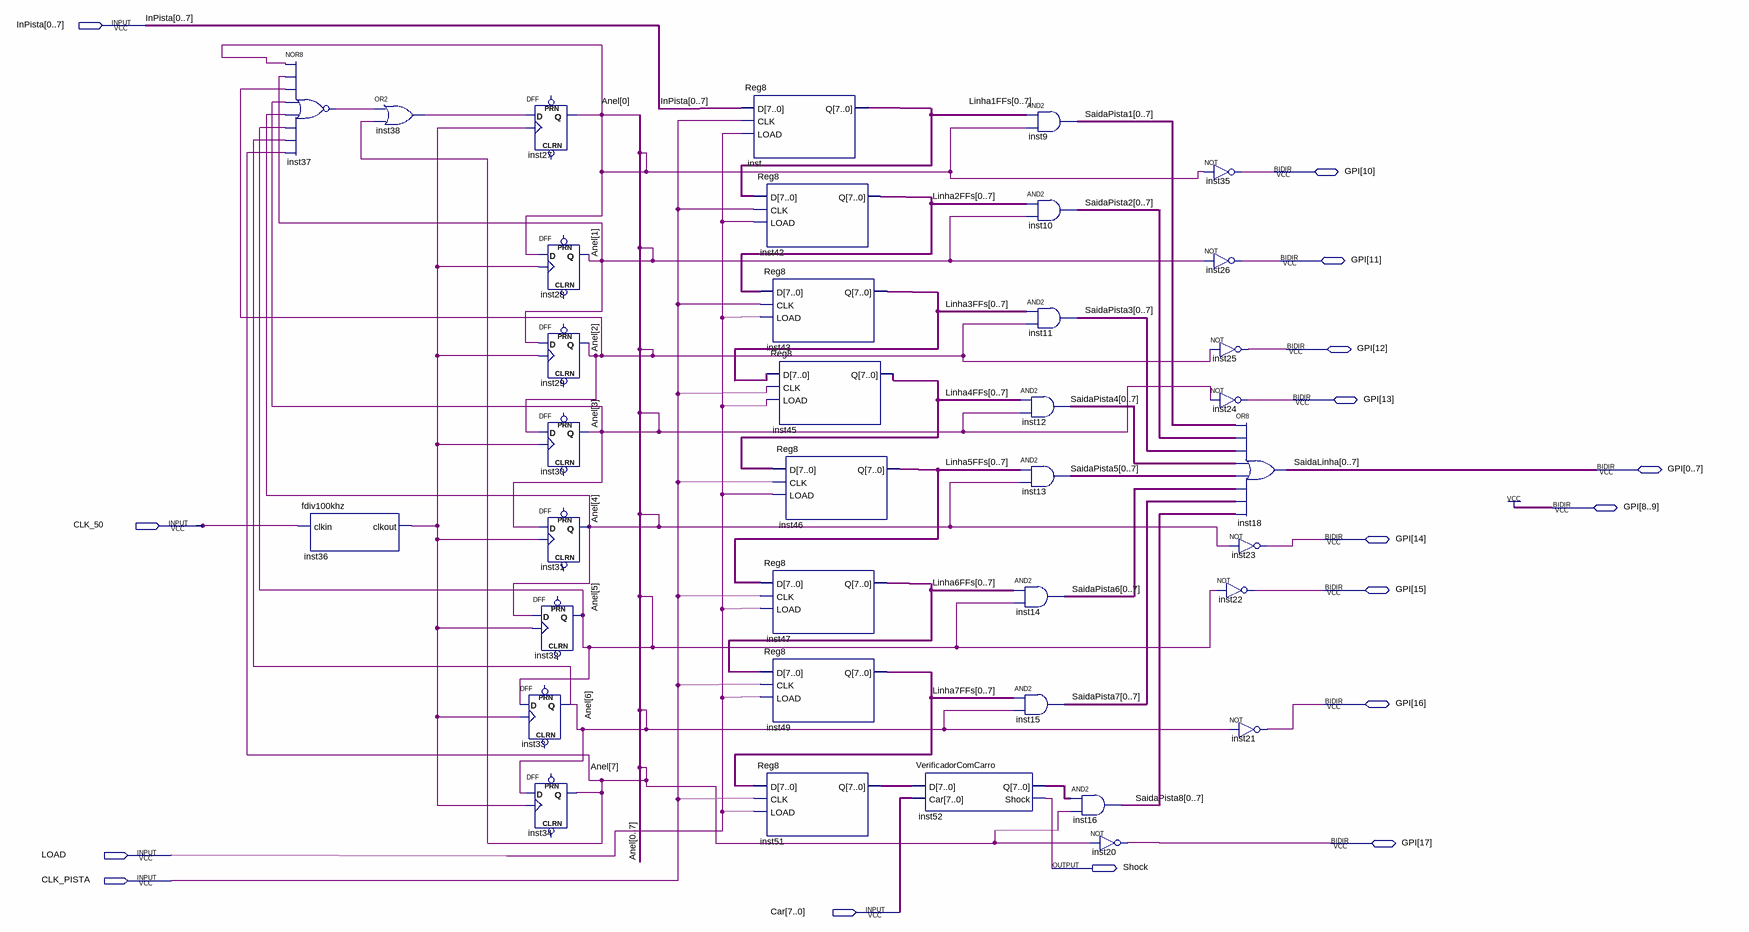
[diagram p0: schematic sheet]
// Quartus schematic ControleMatriz.bdf as structural Verilog: 37 symbols, 16 pins
module ControleMatriz (
  input  [0:7] InPista,
  input  CLK_50,
  input  LOAD,
  input  CLK_PISTA,
  input  [7:0] Car,
  inout  [0:17] GPI,
  output Shock
);

  wire inst36_clkout, inst37_out, inst38_out;
  wire [7:0] Anel, inst51_q, inst52_q, Linha1FFs, Linha2FFs, Linha3FFs, Linha4FFs, Linha5FFs, Linha6FFs,
       Linha7FFs, SaidaPista1, SaidaPista2, SaidaPista3, SaidaPista4, SaidaPista5, SaidaPista6, SaidaPista7,
       SaidaPista8;

  nor inst37 (inst37_out, Anel[0], Anel[1], Anel[2], Anel[3], Anel[4], Anel[5], Anel[6], Anel[7]);
  fdiv100khz inst36 (.clkin(CLK_50), .clkout(inst36_clkout));
  or inst38 (inst38_out, inst37_out, Anel[7]);
  DFF inst27 (.CLK(inst36_clkout), .D(inst38_out), .Q(Anel[0]));  // open: CLRN, PRN
  DFF inst33 (.CLK(inst36_clkout), .D(Anel[5]), .Q(Anel[6]));  // open: CLRN, PRN
  DFF inst34 (.CLK(inst36_clkout), .D(Anel[6]), .Q(Anel[7]));  // open: CLRN, PRN
  DFF inst28 (.CLK(inst36_clkout), .D(Anel[0]), .Q(Anel[1]));  // open: CLRN, PRN
  DFF inst29 (.CLK(inst36_clkout), .D(Anel[1]), .Q(Anel[2]));  // open: CLRN, PRN
  DFF inst30 (.CLK(inst36_clkout), .D(Anel[2]), .Q(Anel[3]));  // open: CLRN, PRN
  DFF inst31 (.CLK(inst36_clkout), .D(Anel[3]), .Q(Anel[4]));  // open: CLRN, PRN
  DFF inst32 (.CLK(inst36_clkout), .D(Anel[4]), .Q(Anel[5]));  // open: CLRN, PRN
  Reg8 inst (
    .D(InPista), .CLK(CLK_PISTA), .LOAD(LOAD),
    .Q({Linha1FFs[0], Linha1FFs[1], Linha1FFs[2], Linha1FFs[3], Linha1FFs[4], Linha1FFs[5], Linha1FFs[6], Linha1FFs[7]}));
  Reg8 inst42 (
    .D({Linha1FFs[0], Linha1FFs[1], Linha1FFs[2], Linha1FFs[3], Linha1FFs[4], Linha1FFs[5], Linha1FFs[6], Linha1FFs[7]}),
    .CLK(CLK_PISTA), .LOAD(LOAD),
    .Q({Linha2FFs[0], Linha2FFs[1], Linha2FFs[2], Linha2FFs[3], Linha2FFs[4], Linha2FFs[5], Linha2FFs[6], Linha2FFs[7]}));
  Reg8 inst43 (
    .D({Linha2FFs[0], Linha2FFs[1], Linha2FFs[2], Linha2FFs[3], Linha2FFs[4], Linha2FFs[5], Linha2FFs[6], Linha2FFs[7]}),
    .CLK(CLK_PISTA), .LOAD(LOAD),
    .Q({Linha3FFs[0], Linha3FFs[1], Linha3FFs[2], Linha3FFs[3], Linha3FFs[4], Linha3FFs[5], Linha3FFs[6], Linha3FFs[7]}));
  Reg8 inst45 (
    .D({Linha3FFs[0], Linha3FFs[1], Linha3FFs[2], Linha3FFs[3], Linha3FFs[4], Linha3FFs[5], Linha3FFs[6], Linha3FFs[7]}),
    .CLK(CLK_PISTA), .LOAD(LOAD),
    .Q({Linha4FFs[0], Linha4FFs[1], Linha4FFs[2], Linha4FFs[3], Linha4FFs[4], Linha4FFs[5], Linha4FFs[6], Linha4FFs[7]}));
  Reg8 inst46 (
    .D({Linha4FFs[0], Linha4FFs[1], Linha4FFs[2], Linha4FFs[3], Linha4FFs[4], Linha4FFs[5], Linha4FFs[6], Linha4FFs[7]}),
    .CLK(CLK_PISTA), .LOAD(LOAD),
    .Q({Linha5FFs[0], Linha5FFs[1], Linha5FFs[2], Linha5FFs[3], Linha5FFs[4], Linha5FFs[5], Linha5FFs[6], Linha5FFs[7]}));
  Reg8 inst47 (
    .D({Linha5FFs[0], Linha5FFs[1], Linha5FFs[2], Linha5FFs[3], Linha5FFs[4], Linha5FFs[5], Linha5FFs[6], Linha5FFs[7]}),
    .CLK(CLK_PISTA), .LOAD(LOAD),
    .Q({Linha6FFs[0], Linha6FFs[1], Linha6FFs[2], Linha6FFs[3], Linha6FFs[4], Linha6FFs[5], Linha6FFs[6], Linha6FFs[7]}));
  Reg8 inst49 (
    .D({Linha6FFs[0], Linha6FFs[1], Linha6FFs[2], Linha6FFs[3], Linha6FFs[4], Linha6FFs[5], Linha6FFs[6], Linha6FFs[7]}),
    .CLK(CLK_PISTA), .LOAD(LOAD),
    .Q({Linha7FFs[0], Linha7FFs[1], Linha7FFs[2], Linha7FFs[3], Linha7FFs[4], Linha7FFs[5], Linha7FFs[6], Linha7FFs[7]}));
  Reg8 inst51 (
    .D({Linha7FFs[0], Linha7FFs[1], Linha7FFs[2], Linha7FFs[3], Linha7FFs[4], Linha7FFs[5], Linha7FFs[6], Linha7FFs[7]}),
    .CLK(CLK_PISTA), .LOAD(LOAD), .Q(inst51_q));
  VerificadorComCarro inst52 (.D(inst51_q), .Car(Car), .Q(inst52_q), .Shock(Shock));
  assign {SaidaPista1[0], SaidaPista1[1], SaidaPista1[2], SaidaPista1[3], SaidaPista1[4], SaidaPista1[5], SaidaPista1[6], SaidaPista1[7]} = {Linha1FFs[0], Linha1FFs[1], Linha1FFs[2], Linha1FFs[3], Linha1FFs[4], Linha1FFs[5], Linha1FFs[6], Linha1FFs[7]} & {8{Anel[0]}};  // AND2 inst9, 8 bits wide
  assign {SaidaPista2[0], SaidaPista2[1], SaidaPista2[2], SaidaPista2[3], SaidaPista2[4], SaidaPista2[5], SaidaPista2[6], SaidaPista2[7]} = {Linha2FFs[0], Linha2FFs[1], Linha2FFs[2], Linha2FFs[3], Linha2FFs[4], Linha2FFs[5], Linha2FFs[6], Linha2FFs[7]} & {8{Anel[1]}};  // AND2 inst10, 8 bits wide
  assign {SaidaPista3[0], SaidaPista3[1], SaidaPista3[2], SaidaPista3[3], SaidaPista3[4], SaidaPista3[5], SaidaPista3[6], SaidaPista3[7]} = {Linha3FFs[0], Linha3FFs[1], Linha3FFs[2], Linha3FFs[3], Linha3FFs[4], Linha3FFs[5], Linha3FFs[6], Linha3FFs[7]} & {8{Anel[2]}};  // AND2 inst11, 8 bits wide
  assign {SaidaPista4[0], SaidaPista4[1], SaidaPista4[2], SaidaPista4[3], SaidaPista4[4], SaidaPista4[5], SaidaPista4[6], SaidaPista4[7]} = {Linha4FFs[0], Linha4FFs[1], Linha4FFs[2], Linha4FFs[3], Linha4FFs[4], Linha4FFs[5], Linha4FFs[6], Linha4FFs[7]} & {8{Anel[3]}};  // AND2 inst12, 8 bits wide
  assign {SaidaPista5[0], SaidaPista5[1], SaidaPista5[2], SaidaPista5[3], SaidaPista5[4], SaidaPista5[5], SaidaPista5[6], SaidaPista5[7]} = {Linha5FFs[0], Linha5FFs[1], Linha5FFs[2], Linha5FFs[3], Linha5FFs[4], Linha5FFs[5], Linha5FFs[6], Linha5FFs[7]} & {8{Anel[4]}};  // AND2 inst13, 8 bits wide
  assign {SaidaPista6[0], SaidaPista6[1], SaidaPista6[2], SaidaPista6[3], SaidaPista6[4], SaidaPista6[5], SaidaPista6[6], SaidaPista6[7]} = {Linha6FFs[0], Linha6FFs[1], Linha6FFs[2], Linha6FFs[3], Linha6FFs[4], Linha6FFs[5], Linha6FFs[6], Linha6FFs[7]} & {8{Anel[5]}};  // AND2 inst14, 8 bits wide
  assign {SaidaPista7[0], SaidaPista7[1], SaidaPista7[2], SaidaPista7[3], SaidaPista7[4], SaidaPista7[5], SaidaPista7[6], SaidaPista7[7]} = {Linha7FFs[0], Linha7FFs[1], Linha7FFs[2], Linha7FFs[3], Linha7FFs[4], Linha7FFs[5], Linha7FFs[6], Linha7FFs[7]} & {8{Anel[6]}};  // AND2 inst15, 8 bits wide
  assign {SaidaPista8[0], SaidaPista8[1], SaidaPista8[2], SaidaPista8[3], SaidaPista8[4], SaidaPista8[5], SaidaPista8[6], SaidaPista8[7]} = inst52_q & {8{Anel[7]}};  // AND2 inst16, 8 bits wide
  not inst20 (GPI[17], Anel[7]);
  not inst35 (GPI[10], Anel[0]);
  not inst26 (GPI[11], Anel[1]);
  not inst25 (GPI[12], Anel[2]);
  not inst24 (GPI[13], Anel[3]);
  assign GPI[0:7] = {SaidaPista1[0], SaidaPista1[1], SaidaPista1[2], SaidaPista1[3], SaidaPista1[4], SaidaPista1[5], SaidaPista1[6], SaidaPista1[7]} | {SaidaPista2[0], SaidaPista2[1], SaidaPista2[2], SaidaPista2[3], SaidaPista2[4], SaidaPista2[5], SaidaPista2[6], SaidaPista2[7]} | {SaidaPista3[0], SaidaPista3[1], SaidaPista3[2], SaidaPista3[3], SaidaPista3[4], SaidaPista3[5], SaidaPista3[6], SaidaPista3[7]} | {SaidaPista4[0], SaidaPista4[1], SaidaPista4[2], SaidaPista4[3], SaidaPista4[4], SaidaPista4[5], SaidaPista4[6], SaidaPista4[7]} | {SaidaPista5[0], SaidaPista5[1], SaidaPista5[2], SaidaPista5[3], SaidaPista5[4], SaidaPista5[5], SaidaPista5[6], SaidaPista5[7]} | {SaidaPista6[0], SaidaPista6[1], SaidaPista6[2], SaidaPista6[3], SaidaPista6[4], SaidaPista6[5], SaidaPista6[6], SaidaPista6[7]} | {SaidaPista7[0], SaidaPista7[1], SaidaPista7[2], SaidaPista7[3], SaidaPista7[4], SaidaPista7[5], SaidaPista7[6], SaidaPista7[7]} | {SaidaPista8[0], SaidaPista8[1], SaidaPista8[2], SaidaPista8[3], SaidaPista8[4], SaidaPista8[5], SaidaPista8[6], SaidaPista8[7]};  // OR8 inst18, 8 bits wide
  not inst23 (GPI[14], Anel[4]);
  not inst22 (GPI[15], Anel[5]);
  not inst21 (GPI[16], Anel[6]);
  // also tied to VCC on the sheet: GPI[8:9]

  // Other names for the same wires on the sheet: SaidaLinha[7:0] = {GPI[7], GPI[6], GPI[5], GPI[4], GPI[3], GPI[2], GPI[1], GPI[0]}
endmodule
